# Altium schematic sheet mcu3.SchDoc
size A4
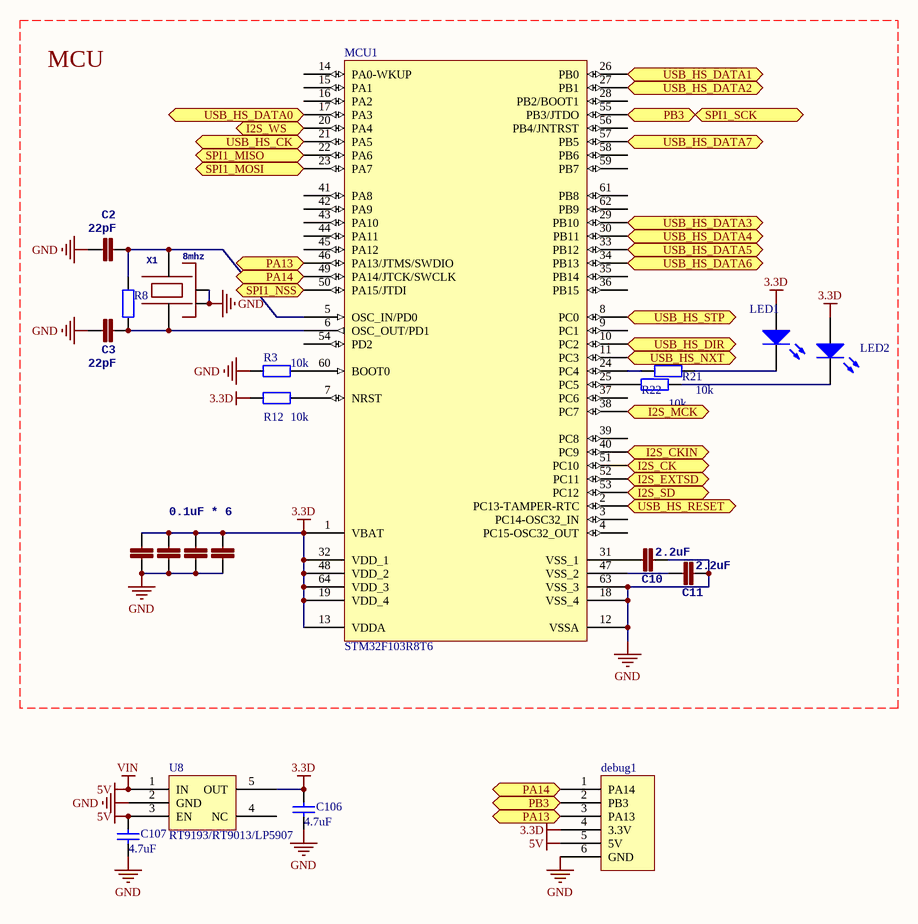
[diagram p0: mcu3.SchDoc]

## Parts
C2  22pF  [0402]
C3  22pF  [0402]
C4  0.1uF * 6  [0402]
C5  1n  [0402]  (value not drawn)
C6  1n  [0402]  (value not drawn)
C7  1n  [0402]  (value not drawn)
C10  2.2uF  [0603]
C11  2.2uF  [0603]
C106  4.7uF  [0603]
C107  4.7uF  [0603]
debug1  debug  [WFRSM125]  (value not drawn)
LED1  LED0  [0603]  (value not drawn)
LED2  LED0  [0603]  (value not drawn)
MCU1  STM32F103R8T6  [LQFP64_N]
R3  10k  [0402]
R8  (no value)  [0402]
R12  10k  [0402]
R21  10k  [0402]
R22  10k  [0402]
U8  RT9193/RT9013/LP5907  [SOT23-5]
X1  8mhz  [OSCILLATOR-3.2X2.5]

## Ports
I2S_CK, I2S_CKIN, I2S_EXTSD, I2S_MCK, I2S_SD, I2S_WS, PA13, PA14, PB3, SPI1_MISO, SPI1_MOSI, SPI1_NSS, SPI1_SCK, USB_HS_CK, USB_HS_DATA0, USB_HS_DATA1, USB_HS_DATA2, USB_HS_DATA3, USB_HS_DATA4, USB_HS_DATA5, USB_HS_DATA6, USB_HS_DATA7, USB_HS_DIR, USB_HS_NXT, USB_HS_RESET, USB_HS_STP

## Nets
3.3D: C4.2 C5.2 C6.2 C7.2 C106.2 debug1.4(3.3V) LED1.1(A) LED2.1(A) MCU1.1(VBAT) MCU1.13(VDDA) MCU1.19(VDD_4) MCU1.32(VDD_1) MCU1.48(VDD_2) MCU1.64(VDD_3) R12.2 U8.5(OUT)
5V: C107.2 debug1.5(5V) U8.1(IN) U8.3(EN)  [also labelled VIN]
GND: C2.2 C3.2 C4.1 C5.1 C6.1 C7.1 C10.2 C11.2 C106.1 C107.1 debug1.6(GND) MCU1.12(VSSA) MCU1.18(VSS_4) MCU1.63(VSS_3) R3.1 U8.2(GND) X1.2(NC_2) X1.4(NC_4)
I2S_CK: MCU1.51(PC10) ; port I2S_CK
I2S_CKIN: MCU1.40(PC9) ; port I2S_CKIN
I2S_EXTSD: MCU1.52(PC11) ; port I2S_EXTSD
I2S_MCK: MCU1.38(PC7) ; port I2S_MCK
I2S_SD: MCU1.53(PC12) ; port I2S_SD
I2S_WS: MCU1.20(PA4) ; port I2S_WS
PA13: debug1.3(PA13) MCU1.46(PA13/JTMS/SWDIO) ; port PA13
PA14: debug1.1(PA14) MCU1.49(PA14/JTCK/SWCLK) ; port PA14
PB3: debug1.2(PB3) MCU1.55(PB3/JTDO) ; port PB3, port SPI1_SCK
SPI1_MISO: MCU1.22(PA6) ; port SPI1_MISO
SPI1_MOSI: MCU1.23(PA7) ; port SPI1_MOSI
SPI1_NSS: MCU1.50(PA15/JTDI) ; port SPI1_NSS
USB_HS_CK: MCU1.21(PA5) ; port USB_HS_CK
USB_HS_DATA0: MCU1.17(PA3) ; port USB_HS_DATA0
USB_HS_DATA1: MCU1.26(PB0) ; port USB_HS_DATA1
USB_HS_DATA2: MCU1.27(PB1) ; port USB_HS_DATA2
USB_HS_DATA3: MCU1.29(PB10) ; port USB_HS_DATA3
USB_HS_DATA4: MCU1.30(PB11) ; port USB_HS_DATA4
USB_HS_DATA5: MCU1.33(PB12) ; port USB_HS_DATA5
USB_HS_DATA6: MCU1.34(PB13) ; port USB_HS_DATA6
USB_HS_DATA7: MCU1.57(PB5) ; port USB_HS_DATA7
USB_HS_DIR: MCU1.10(PC2) ; port USB_HS_DIR
USB_HS_NXT: MCU1.11(PC3) ; port USB_HS_NXT
USB_HS_RESET: MCU1.2(PC13-TAMPER-RTC) ; port USB_HS_RESET
USB_HS_STP: MCU1.8(PC0) ; port USB_HS_STP
NetC2_1: C2.1 MCU1.5(OSC_IN/PD0) R8.2 X1.3
NetC3_1: C3.1 MCU1.6(OSC_OUT/PD1) R8.1 X1.1
NetC10_1: C10.1 MCU1.31(VSS_1)
NetC11_1: C11.1 MCU1.47(VSS_2)
NetLED1_2: LED1.2(K) R21.2
NetLED2_2: LED2.2(K) R22.2
NetMCU1_7: MCU1.7(NRST) R12.1
NetMCU1_24: MCU1.24(PC4) R21.1
NetMCU1_25: MCU1.25(PC5) R22.1
NetMCU1_60: MCU1.60(BOOT0) R3.2

Not connected (* = marked no-connect by the designer): MCU1 3(PC14-OSC32_IN) 4(PC15-OSC32_OUT) 9(PC1) 14(PA0-WKUP) 15(PA1) 16(PA2) 28(PB2/BOOT1) 35(PB14) 36(PB15) 37(PC6) 39(PC8) 41(PA8) 42(PA9) 43(PA10) 44(PA11) 45(PA12) 54(PD2) 56(PB4/JNTRST) 58(PB6) 59(PB7) 61(PB8) 62(PB9); U8 4(NC)

## Notes on the sheet
- MCU

## Library data of the parts
C2-C7 C10 C11 = CAP0402-CAP: <b>Capacitor</b> / Standard 0603 ceramic capacitor, and 0.1" leaded capacitor.; PARTNO: CC0402ZRY5V7BB104
C106 C107 = Cap: Capacitor; Published: 8-Jun-2000; LatestRevisionDate: 17-Jul-2002; LatestRevisionNote: Re-released for DXP Platform.; PackageReference: RAD-0.3; Publisher: Altium Limited; PackageDescription: Radial Cap, Thru-Hole; 2 Leads; 0.3 in Pin Spacing
LED1 LED2 = LED0: Typical INFRARED GaAs LED; Published: 8-Jun-2000; LatestRevisionDate: 08-Jul-2005; LatestRevisionNote: Mech Layer 1 removed.; PackageReference: LED-0; Publisher: Altium Limited; PackageDescription: LED; 2 Leads
MCU1 = STM32F103R8T6: STM32 ARM-based 32-bit MCU with 64 Kbytes Flash, 64-pin LQFP, Industrial Temperature; Published: *; DatasheetVersion: *; PackageVersion: *; PackageReference: *; Publisher: *; PackageDescription: *; ComponentLink1Description: *; ComponentLink1URL: *; ComponentLink2Description: *; ComponentLink2URL: *
R3 R8 R12 R21 R22 = Res2: Resistor; Value: 0Ohm; Published: 8-Jun-2000; LatestRevisionDate: 17-Jul-2002; LatestRevisionNote: Re-released for DXP Platform.; PackageReference: AXIAL-0.4; Publisher: Altium Limited; PackageDescription: Axial Device, Thru-Hole; 2 Leads; 0.4 in Pin Spacing
U8 = LP5907
X1 = OSCILLATOR-3.2X2.5: Crystal Oscillator in 3.2x2.5 SMD